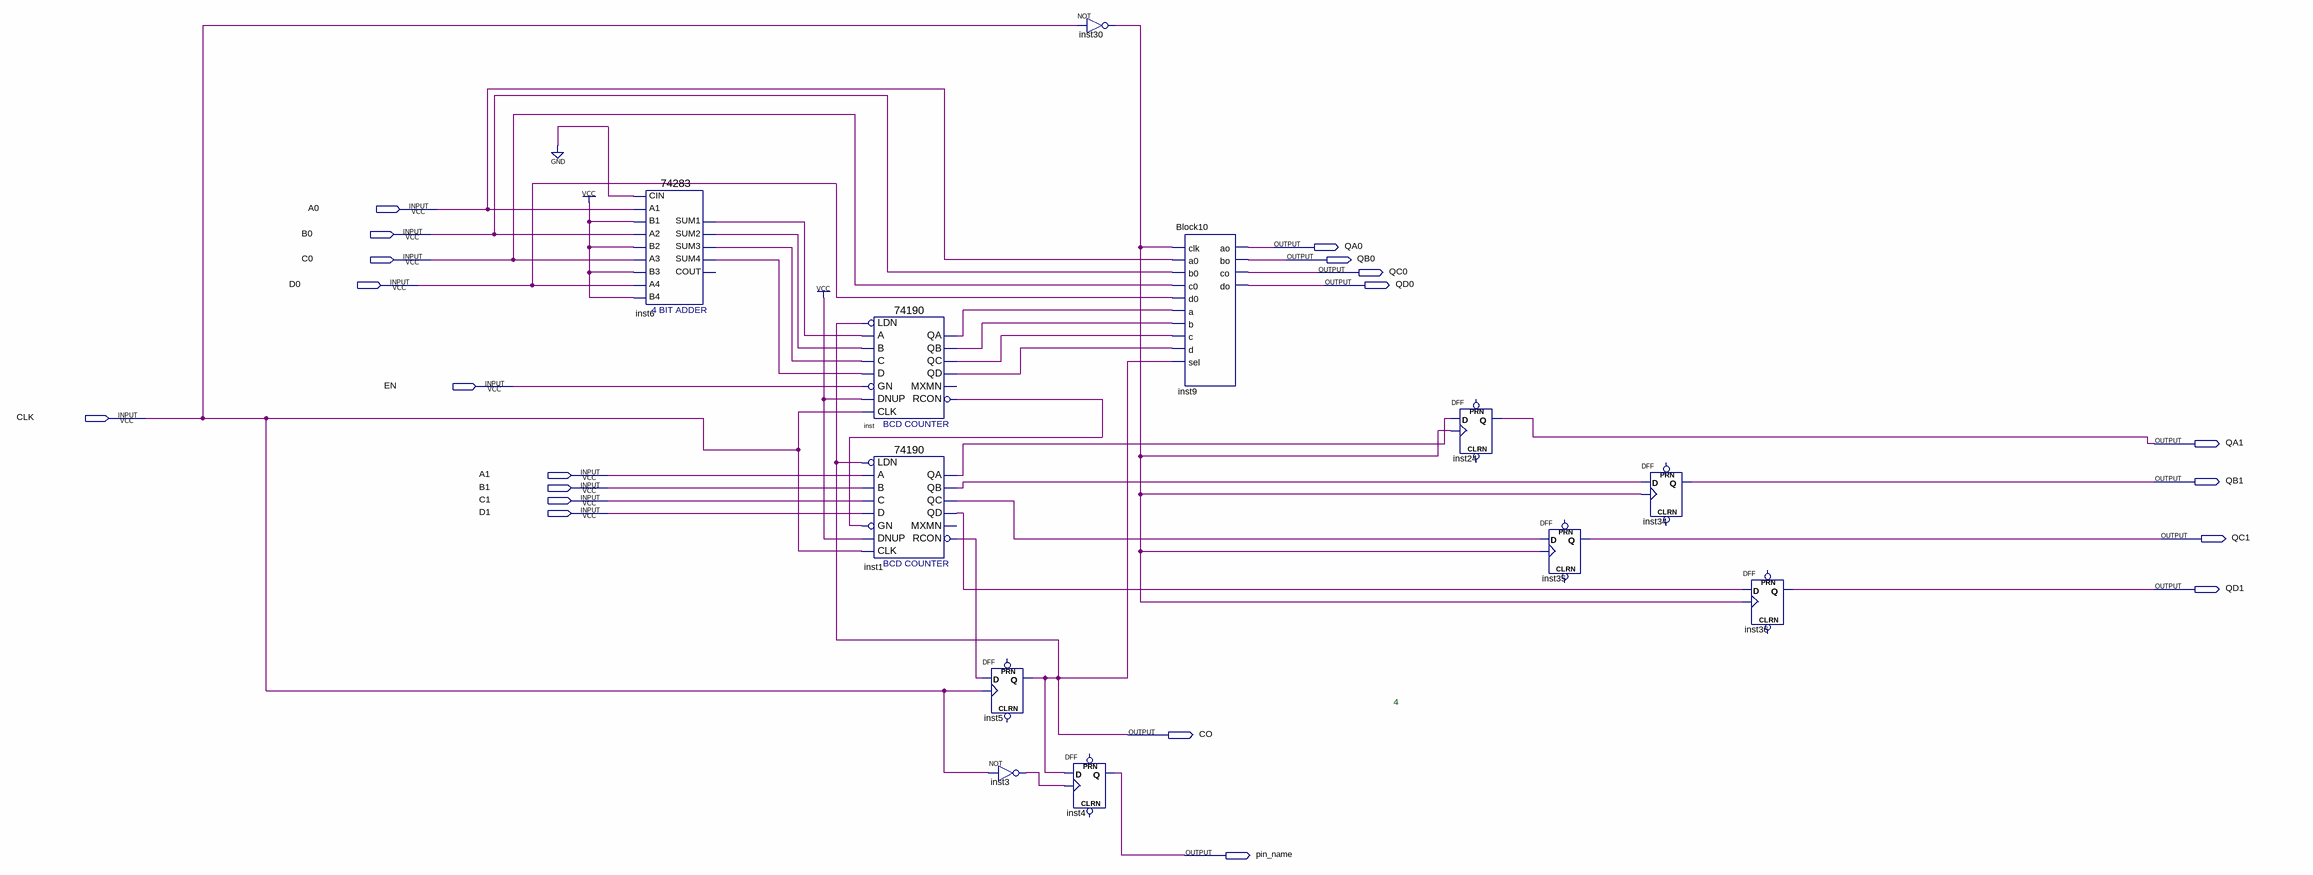
[diagram p0: schematic sheet]
// Quartus schematic Block4.bdf as structural Verilog: 12 symbols, 20 pins
module Block4 (
  input  A0,
  input  B0,
  input  C0,
  input  D0,
  input  EN,
  input  CLK,
  input  A1,
  input  B1,
  input  C1,
  input  D1,
  output QA0,
  output QB0,
  output QC0,
  output QD0,
  output QA1,
  output QB1,
  output QC1,
  output QD1,
  output CO,
  output pin_name
);

  wire inst1_qa, inst1_qb, inst1_qc, inst1_qd, inst1_rcon, inst3_out, inst6_sum1, inst6_sum2, inst6_sum3,
       inst6_sum4, inst30_out, inst_qa, inst_qb, inst_qc, inst_qd, inst_rcon;

  \74283  inst6 (
    .CIN(1'b0), .A1(A0), .A2(B0), .B2(1'b1), .A3(C0), .A4(D0), .B4(1'b1), .B1(1'b1), .B3(1'b1),
    .SUM4(inst6_sum4), .SUM1(inst6_sum1), .SUM2(inst6_sum2), .SUM3(inst6_sum3));  // open: COUT
  \74190  inst (
    .LDN(CO), .A(inst6_sum1), .C(inst6_sum3), .B(inst6_sum2), .D(inst6_sum4), .GN(EN), .CLK(CLK),
    .DNUP(1'b1), .QA(inst_qa), .QB(inst_qb), .QD(inst_qd), .QC(inst_qc), .RCON(inst_rcon));  // open: MXMN
  \74190  inst1 (
    .LDN(CO), .A(A1), .C(C1), .B(B1), .D(D1), .GN(inst_rcon), .CLK(CLK), .DNUP(1'b1), .QA(inst1_qa),
    .QB(inst1_qb), .QD(inst1_qd), .QC(inst1_qc), .RCON(inst1_rcon));  // open: MXMN
  DFF inst5 (.CLK(CLK), .D(inst1_rcon), .Q(CO));  // open: CLRN, PRN
  not inst3 (inst3_out, CLK);
  not inst30 (inst30_out, CLK);
  DFF inst4 (.CLK(inst3_out), .D(CO), .Q(pin_name));  // open: CLRN, PRN
  Block10 inst9 (
    .clk(inst30_out), .a0(A0), .b0(B0), .c0(C0), .d0(D0), .a(inst_qa), .b(inst_qb), .c(inst_qc), .d(inst_qd),
    .sel(CO), .ao(QA0), .bo(QB0), .co(QC0), .\do (QD0));
  DFF inst24 (.CLK(inst30_out), .D(inst1_qa), .Q(QA1));  // open: CLRN, PRN
  DFF inst35 (.CLK(inst30_out), .D(inst1_qc), .Q(QC1));  // open: CLRN, PRN
  DFF inst34 (.CLK(inst30_out), .D(inst1_qb), .Q(QB1));  // open: CLRN, PRN
  DFF inst36 (.CLK(inst30_out), .D(inst1_qd), .Q(QD1));  // open: CLRN, PRN

  // Notes on the sheet:
  //   4
endmodule
